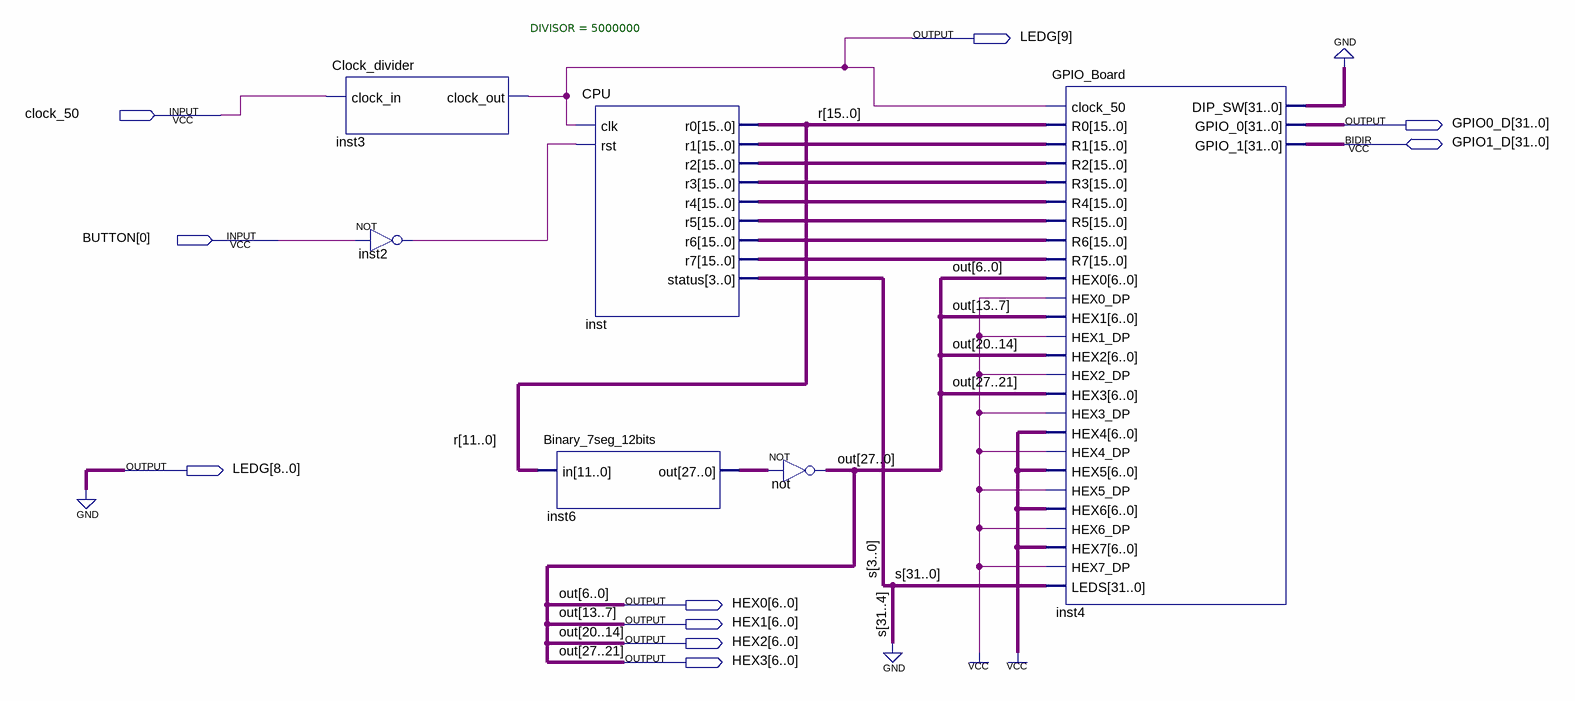
[diagram p0: schematic sheet]
// Quartus schematic FibBoard.bdf as structural Verilog: 6 symbols, 10 pins
module FibBoard (
  input  clock_50,
  input  [0:0] BUTTON,
  inout  [31:0] GPIO1_D,
  output [9:0] LEDG,
  output [31:0] GPIO0_D,
  output [6:0] HEX0,
  output [6:0] HEX1,
  output [6:0] HEX2,
  output [6:0] HEX3
);

  wire inst2_out;
  wire [3:0] s;
  wire [15:0] inst_r1, inst_r2, inst_r3, inst_r4, inst_r5, inst_r6, inst_r7, r;
  wire [27:0] inst6_out;
  wire [31:0] inst4_dip_sw;

  Clock_divider #(.DIVISOR(5000000)) inst3 (.clock_in(clock_50), .clock_out(LEDG[9]));
  not inst2 (inst2_out, BUTTON[0]);
  Binary_7seg_12bits inst6 (.in(r[11:0]), .out(inst6_out));
  CPU inst (
    .clk(LEDG[9]), .rst(inst2_out), .r0(r), .r1(inst_r1), .r2(inst_r2), .r3(inst_r3), .r4(inst_r4),
    .r5(inst_r5), .r6(inst_r6), .r7(inst_r7), .status(s));
  assign {HEX3, HEX2, HEX1, HEX0} = ~inst6_out;  // NOT not, 28 bits wide
  GPIO_Board inst4 (
    .clock_50(LEDG[9]), .R0(r), .R1(inst_r1), .R2(inst_r2), .R3(inst_r3), .R4(inst_r4), .R5(inst_r5),
    .R6(inst_r6), .R7(inst_r7), .HEX0(HEX0), .HEX0_DP(1'b1), .HEX1(HEX1), .HEX1_DP(1'b1), .HEX2(HEX2),
    .HEX2_DP(1'b1), .HEX3(HEX3), .HEX3_DP(1'b1), .HEX4({7{1'b1}}), .HEX4_DP(1'b1), .HEX5({7{1'b1}}),
    .HEX5_DP(1'b1), .HEX6({7{1'b1}}), .HEX6_DP(1'b1), .HEX7({7{1'b1}}), .HEX7_DP(1'b1),
    .LEDS({{28{1'b0}}, s}), .DIP_SW(inst4_dip_sw), .GPIO_0(GPIO0_D), .GPIO_1(GPIO1_D));

  assign LEDG[8:0] = {9{1'b0}};
  // also tied to GND on the sheet: {inst4_dip_sw[0], inst4_dip_sw[1], inst4_dip_sw[2], inst4_dip_sw[3], inst4_dip_sw[4], inst4_dip_sw[5], inst4_dip_sw[6], inst4_dip_sw[7], inst4_dip_sw[8], inst4_dip_sw[9], inst4_dip_sw[10], inst4_dip_sw[11], inst4_dip_sw[12], inst4_dip_sw[13], inst4_dip_sw[14], inst4_dip_sw[15], inst4_dip_sw[16], inst4_dip_sw[17], inst4_dip_sw[18], inst4_dip_sw[19], inst4_dip_sw[20], inst4_dip_sw[21], inst4_dip_sw[22], inst4_dip_sw[23], inst4_dip_sw[24], inst4_dip_sw[25], inst4_dip_sw[26], inst4_dip_sw[27], inst4_dip_sw[28], inst4_dip_sw[29], inst4_dip_sw[30], inst4_dip_sw[31]}

  // Other names for the same wires on the sheet: out[27:0] = {HEX3, HEX2, HEX1, HEX0}
endmodule
